# Altium schematic sheet CH32F203C8T6-R1.SchDoc
size 436 x 317 mm; SheetNumber: 1; SheetTotal: 1
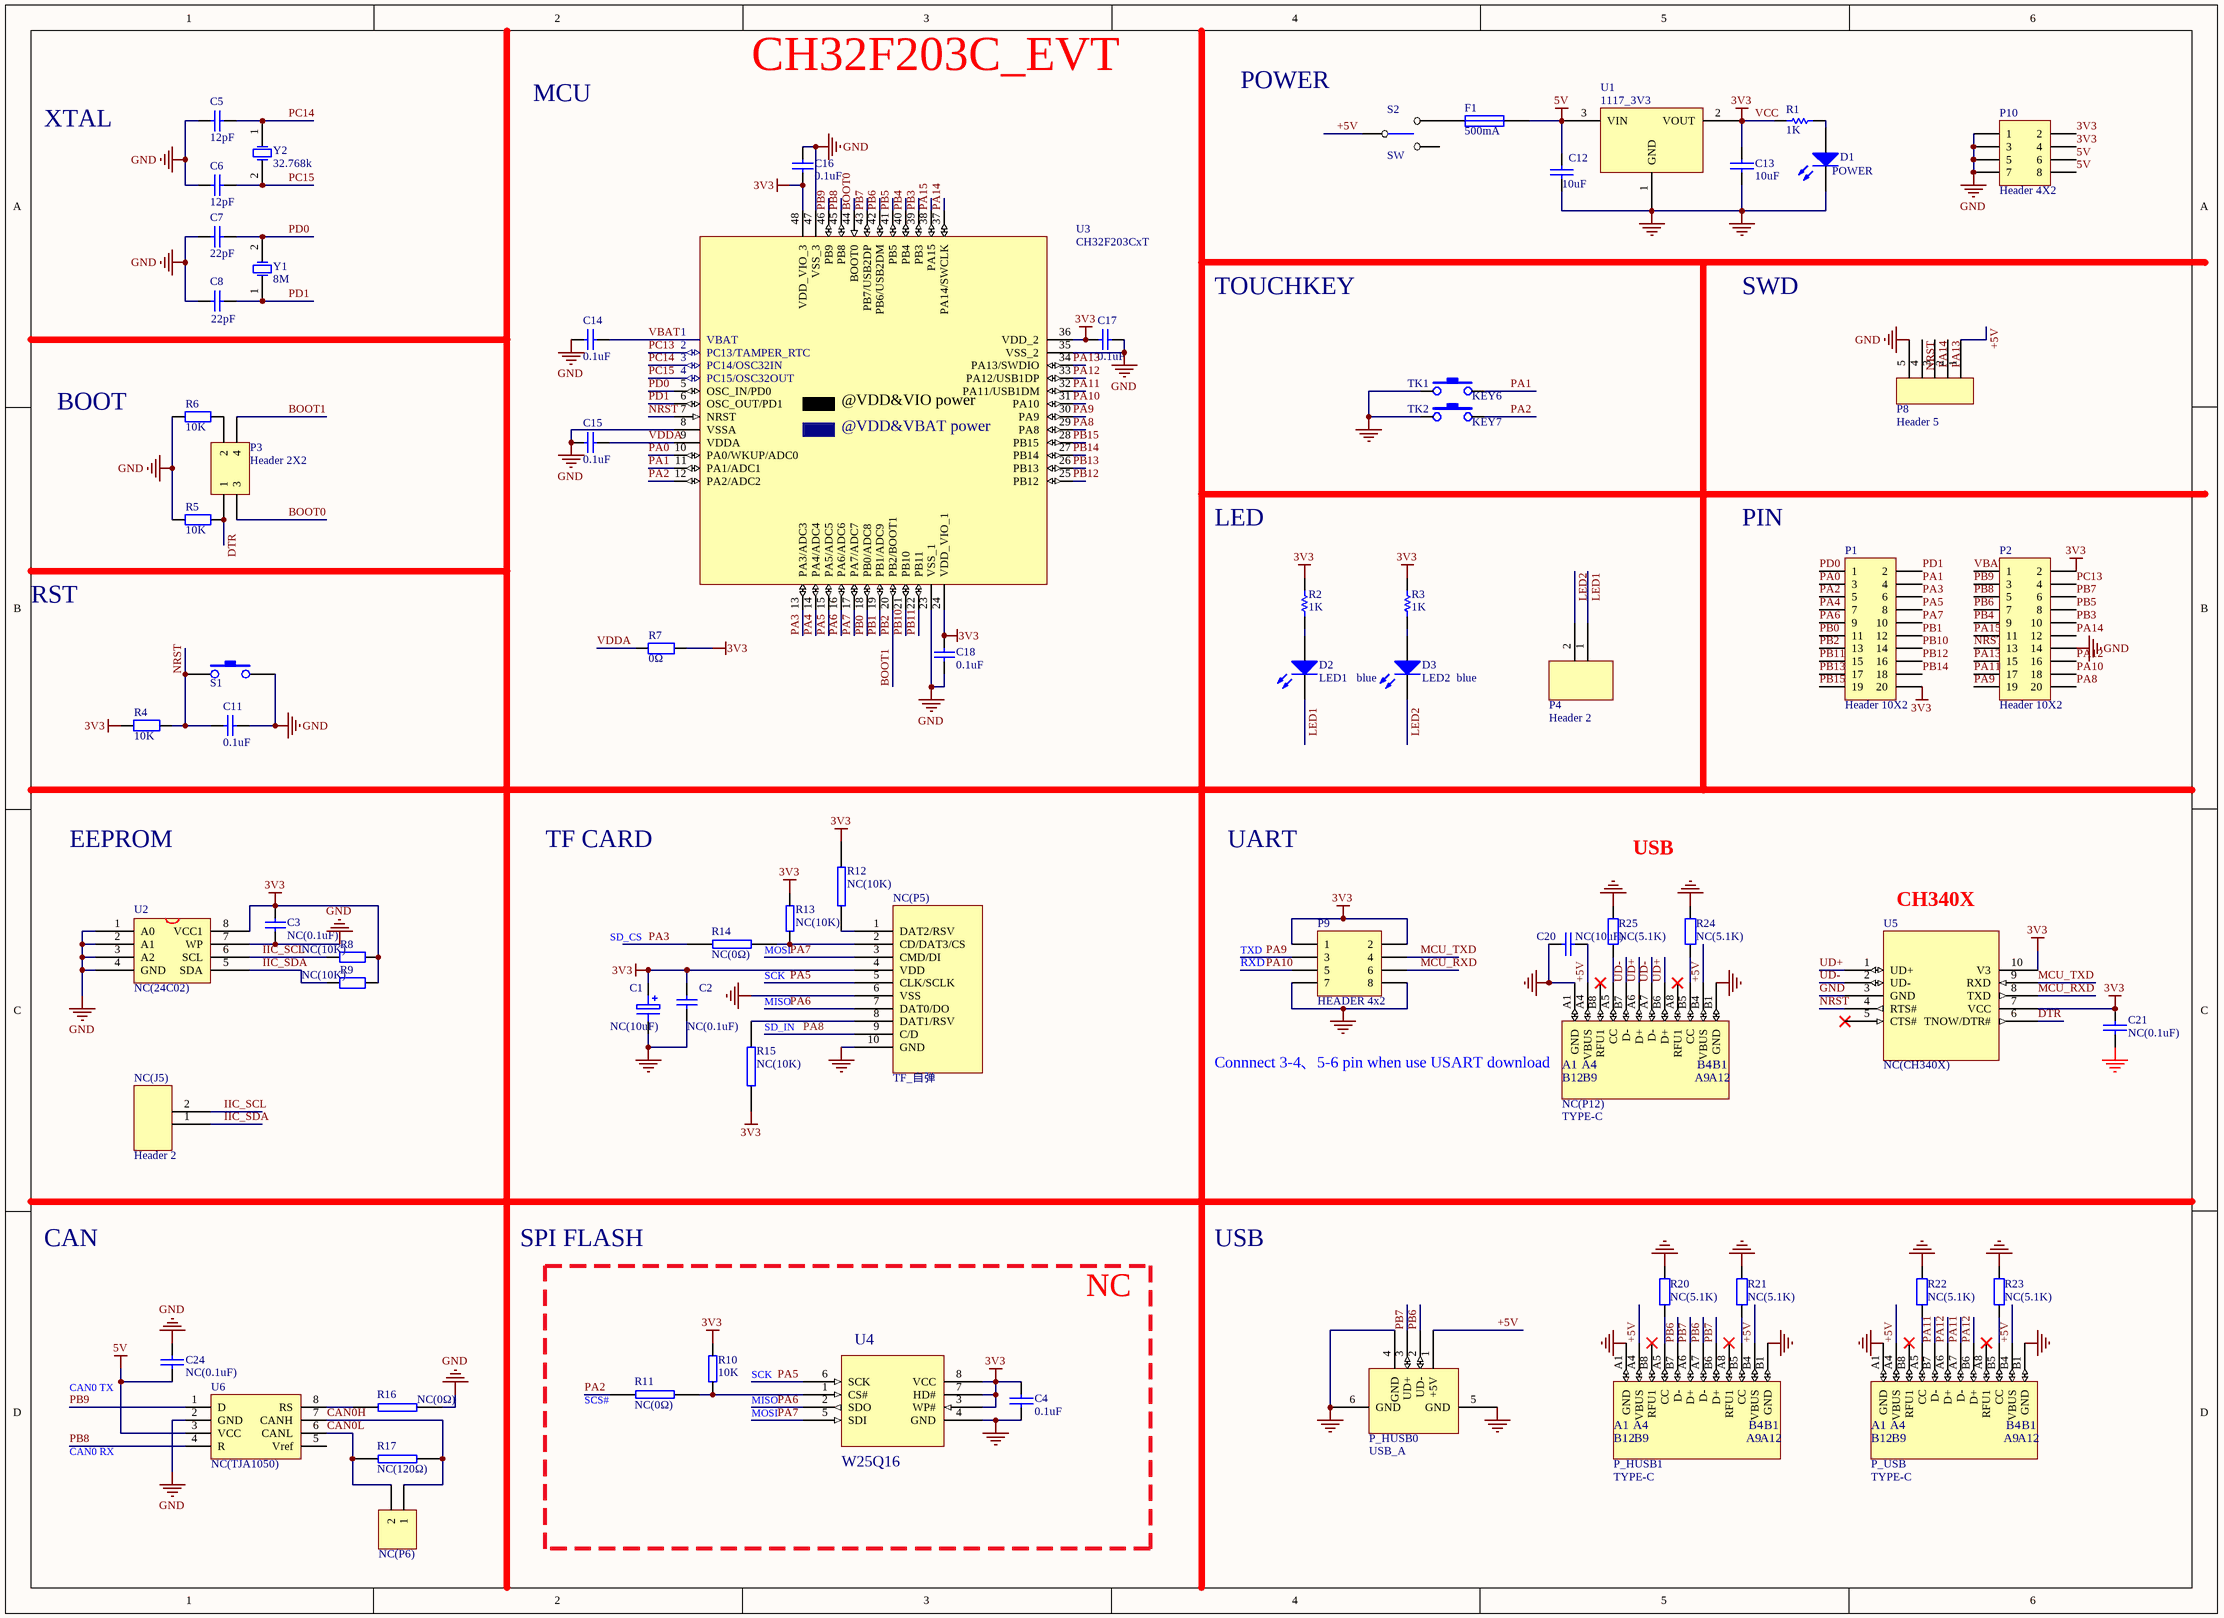
[diagram p0: CH32F203C8T6-R1.SchDoc]

## Parts
C1  NC(10uF)  [3216]
C2  value NC(0.1uF)  [0603]  (hidden comment: 0.1uF)
C3  NC(0.1uF)  [0603]
C4  0.1uF  [0603]
C5  12pF  [0603]
C6  12pF  [0603]
C7  22pF  [0603]
C8  22pF  [0603]
C11  0.1uF  [0603]
C12  10uF  [3216]
C13  10uF  [0603]
C14  0.1uF  [0603]
C15  0.1uF  [0603]
C16  0.1uF  [0603]
C17  0.1uF  [0603]
C18  0.1uF  [0603]
C20  NC(10uF)  [3216_C]
C21  NC(0.1uF)  [0603_C]
C24  NC(0.1uF)  [0603]
D1  POWER  [0603L]
D2  LED1   blue  [0603L]
D3  LED2  blue  [0603L]
F1  500mA  [0603]
NC(J5)  Header 2  [SIP2 - 40mil]
NC(P5)  TF_自弹  [TF_CARD]
NC(P6)  Header 2  [PORT2 4.5MM]  (value not drawn)
NC(P12)  TYPE-C  [TYPE-C-Receptacle-2.0]
P1  Header 10X2  [IDC20]
P2  Header 10X2  [IDC20]
P3  Header 2X2  [HDR2X2]
P4  Header 2  [SIP2 - 40mil]
P8  Header 5  [SIP5 - 40mil]
P9  HEADER 4x2  [IDC8-2.54mm]
P10  Header 4X2  [IDC8]
P_HUSB0  USB_A  [USBA-l]
P_HUSB1  TYPE-C  [TYPE-C-Receptacle-2.0]
P_USB  TYPE-C  [TYPE-C-Receptacle-2.0]
R1  1K  [0603]
R2  1K  [0603]
R3  1K  [0603]
R4  10K  [0603]
R5  10K  [0603]
R6  10K  [0603]
R7  0Ω  [0603]
R8  NC(10K)  [0603]
R9  NC(10K)  [0603]
R10  10K  [0603]
R11  NC(0Ω)  [0603]
R12  NC(10K)  [0603]
R13  NC(10K)  [0603]
R14  NC(0Ω)  [0603]
R15  NC(10K)  [0603]
R16  NC(0Ω)  [0603]
R17  NC(120Ω)  [0603]
R20  NC(5.1K)  [0603]
R21  NC(5.1K)  [0603]
R22  NC(5.1K)  [0603]
R23  NC(5.1K)  [0603]
R24  NC(5.1K)  [0603]
R25  NC(5.1K)  [0603]
S1  KEY  [贴片按键]  (value not drawn)
S2  SW  [KEY2]
TK1  KEY6  [KEY68]
TK2  KEY7  [KEY68]
U1  1117_3V3  [SOT-223]
U2  NC(24C02)  [SOP8]
U3  CH32F203CxT  [LQFP48]
U4  W25Q16  [016 SO-8]
U5  NC(CH340X)  [MSOP10]
U6  NC(TJA1050)  [SOP8]
Y1  8M  [XT62/28]
Y2  32.768k  [FC-135]

## Blocks framed on the sheet
NC: C4 R10 R11 U4

## Nets
3V3: C1.1 C2.1 C3.2 C4.2 C13.1 C16.2 C17.2 C18.2 C21.1 NC(P5).4(VDD) P1.20 P2.2 P9.1 P9.2 P10.2 P10.4 R1.2 R2.1 R3.1 R4.2 R7.1 R8.1 R9.1 R10.2 R12.2 R13.2 R15.1 U1.2(VOUT) U2.8(VCC1) U3.24(VDD_VIO_1) U3.36(VDD_2) U3.48(VDD_VIO_3) U4.3(WP#) U4.7(HD#) U4.8(VCC) U5.7(VCC) U5.10(V3)  [also labelled VCC]
5V: C12.1 C24.2 F1.2 P10.6 P10.8 U1.3(VIN) U6.3(VCC)
GND: C1.2 C2.2 C3.1 C4.1 C5.2 C6.2 C7.1 C8.1 C11.1 C12.2 C13.2 C14.2 C15.2 C16.1 C17.1 C18.1 C20.1 C21.2 C24.1 D1.2(K) NC(P5).6(VSS) NC(P5).10(GND) NC(P12).A1(GND) NC(P12).B1(GND) P2.14 P8.5 P9.7 P9.8 P10.1 P10.3 P10.5 P10.7 P_HUSB0.4(GND) P_HUSB0.5(GND) P_HUSB0.6(GND) P_HUSB1.A1(GND) P_HUSB1.B1(GND) P_USB.A1(GND) P_USB.B1(GND) R5.2 R6.2 R16.1 R20.2 R21.2 R22.2 R23.2 R24.2 R25.2 S1.3 TK1.3 TK2.3 U1.1(GND) U2.1(A0) U2.2(A1) U2.3(A2) U2.4(GND) U2.7(WP) U3.8(VSSA) U3.23(VSS_1) U3.35(VSS_2) U3.47(VSS_3) U4.4(GND) U5.3(GND) U6.2(GND)
+5V: C20.2 NC(P12).A4(VBUS) NC(P12).B4(VBUS) P8.1 P_HUSB0.1(+5V) P_HUSB1.A4(VBUS) P_HUSB1.B4(VBUS) P_USB.A4(VBUS) P_USB.B4(VBUS) S2.1
BOOT0: P3.3 U3.44(BOOT0)
BOOT1: P1.13 P3.4 U3.20(PB2/BOOT1)  [also labelled PB2]
CAN0H: NC(P6).1 R17.1 U6.7(CANH)
CAN0L: NC(P6).2 R17.2 U6.6(CANL)
DTR: P3.1 R5.1 U5.6(TNOW/DTR#)
IIC_SCL: NC(J5).2 R8.2 U2.6(SCL)
IIC_SDA: NC(J5).1 R9.2 U2.5(SDA)
LED1: D2.2(K) P4.1
LED2: D3.2(K) P4.2
MCU_RXD: P9.6 U5.8(TXD)
MCU_TXD: P9.4 U5.9(RXD)
NRST: C11.2 P2.13 P8.4 R4.1 S1.1 U3.7(NRST) U5.4(RTS#)
PA0: P1.3 U3.10(PA0/WKUP/ADC0)
PA1: P1.4 TK1.1 U3.11(PA1/ADC1)
PA2: P1.5 R11.2 TK2.1 U3.12(PA2/ADC2)
PA3: P1.6 R14.2 U3.13(PA3/ADC3)
PA4: P1.7 U3.14(PA4/ADC4)
PA5: NC(P5).5(CLK/SCLK) P1.8 U3.15(PA5/ADC5) U4.6(SCK)
PA6: NC(P5).7(DAT0/DO) P1.9 U3.16(PA6/ADC6) U4.2(SDO)
PA7: NC(P5).3(CMD/DI) P1.10 U3.17(PA7/ADC7) U4.5(SDI)
PA8: NC(P5).9(C/D) P2.20 U3.29(PA8)
PA9: P2.19 P9.3 U3.30(PA9)
PA10: P2.18 P9.5 U3.31(PA10)
PA11: P2.17 P_USB.A7(D-) P_USB.B7(D-) U3.32(PA11/USB1DM)
PA12: P2.16 P_USB.A6(D+) P_USB.B6(D+) U3.33(PA12/USB1DP)
PA13: P2.15 P8.2 U3.34(PA13/SWDIO)
PA14: P2.12 P8.3 U3.37(PA14/SWCLK)
PA15: P2.11 U3.38(PA15)
PB0: P1.11 U3.18(PB0/ADC8)
PB1: P1.12 U3.19(PB1/ADC9)
PB3: P2.10 U3.39(PB3)
PB4: P2.9 U3.40(PB4)
PB5: P2.8 U3.41(PB5)
PB6: P2.7 P_HUSB0.2(UD-) P_HUSB1.A7(D-) P_HUSB1.B7(D-) U3.42(PB6/USB2DM)
PB7: P2.6 P_HUSB0.3(UD+) P_HUSB1.A6(D+) P_HUSB1.B6(D+) U3.43(PB7/USB2DP)
PB8: P2.5 U3.45(PB8) U6.4(R)
PB9: P2.3 U3.46(PB9) U6.1(D)
PB10: P1.14 U3.21(PB10)
PB11: P1.15 U3.22(PB11)
PB12: P1.16 U3.25(PB12)
PB13: P1.17 U3.26(PB13)
PB14: P1.18 U3.27(PB14)
PB15: P1.19 U3.28(PB15)
PC13: P2.4 U3.2(PC13/TAMPER_RTC)
PC14: C5.1 U3.3(PC14/OSC32IN) Y2.1(OSC1)
PC15: C6.1 U3.4(PC15/OSC32OUT) Y2.2(OSC2)
PD0: C7.2 P1.1 U3.5(OSC_IN/PD0) Y1.2(OSC2)
PD1: C8.2 P1.2 U3.6(OSC_OUT/PD1) Y1.1(OSC1)
UD+: NC(P12).A6(D+) NC(P12).B6(D+) U5.1(UD+)
UD-: NC(P12).A7(D-) NC(P12).B7(D-) U5.2(UD-)
VBAT: C14.1 P2.1 U3.1(VBAT)
VDDA: C15.1 R7.2 U3.9(VDDA)
NetD1_1: D1.1(A) R1.1
NetD2_1: D2.1(A) R2.2
NetD3_1: D3.1(A) R3.2
NetF1_1: F1.1 S2.2
NetNC(P5)_1: NC(P5).1(DAT2/RSV) R12.1
NetNC(P5)_2: NC(P5).2(CD/DAT3/CS) R13.1 R14.1
NetNC(P5)_8: NC(P5).8(DAT1/RSV) R15.2
NetNC(P12)_A5: NC(P12).A5(CC) R25.1
NetNC(P12)_B5: NC(P12).B5(CC) R24.1
NetP3_2: P3.2 R6.1
NetP_HUSB1_A5: P_HUSB1.A5(CC) R20.1
NetP_HUSB1_B5: P_HUSB1.B5(CC) R21.1
NetP_USB_A5: P_USB.A5(CC) R22.1
NetP_USB_B5: P_USB.B5(CC) R23.1
NetR10_1: R10.1 R11.1 U4.1(CS#)
NetR16_2: R16.2 U6.8(RS)

Not connected (* = marked no-connect by the designer): NC(P12) A8(RFU1)* B8(RFU1)*; P_HUSB1 A8(RFU1)* B8(RFU1)*; P_USB A8(RFU1)* B8(RFU1)*; S2 3; U5 5(CTS#)*; U6 5(Vref)

## Notes on the sheet
- CH32F203C_EVT
- POWER
- XTAL
- MCU
- TOUCHKEY
- SWD
- BOOT
- LED
- PIN
- RST
- EEPROM
- TF CARD
- UART
- USB
- CH340X
- SD_CS
- MOSI
- SCK
- RXD
- TXD
- MISO
- (near R15) SD_IN
- (near NC(P12)) Connnect 3-4、5-6 pin when use USART download
- CAN
- SPI FLASH
- (near R10) SCK
- CAN0 TX
- (near R11) SCS#
- (near R10) MISO
- CAN0 RX
- (in symbol CH32F203CxT) @VDD&VIO power; @VDD&VBAT power
- (in symbol TYPE-C1) B12; B9; A9; A12

## Library data of the parts
C1 = ELECTRO1: Electrolytic Capacitor; Value: 10uF/16V
C2 C3 C5-C8 C11 C14-C18 = Cap: Capacitor; Published: 8-Jun-2000; Publisher: Altium Limited
  C2: Revision: July-2002: Re-released for DXP Platform.
  C3 C5-C8 C14 C15 C17 C18: LatestRevisionDate: 17-Jul-2002; LatestRevisionNote: Re-released for DXP Platform.; PackageReference: RAD-0.3
  C11 C16: LatestRevisionDate: 17-Jul-2002; LatestRevisionNote: Re-released for DXP Platform.; PackageReference: RAD-0.3; Value: 0.1uF
C4 C12 C13 C20 C21 C24 = CAP: Capacitor
D1-D3 = LED0: Typical INFRARED GaAs LED; Published: 8-Jun-2000; LatestRevisionDate: 08-Jul-2005; LatestRevisionNote: Mech Layer 1 removed.; PackageReference: LED-0; Publisher: Altium Limited
F1 = FUSE1: Fuse
NC(J5) P4 P8 = 2HEAD
NC(P6) = Header 2: Header, 2-Pin; LatestRevisionDate: 17-Jul-2002; LatestRevisionNote: Re-released for DXP Platform.; Publisher: Altium Limited
NC(P12) P_HUSB1 P_USB = TYPE-C1
P1 P2 = Header 10X2: Header, 10-Pin, Dual row; LatestRevisionDate: 17-Jul-2002; LatestRevisionNote: Re-released for DXP Platform.; Publisher: Altium Limited
P3 = Header 2X2: Header, 2-Pin, Dual row; LatestRevisionDate: 17-Jul-2002; LatestRevisionNote: Re-released for DXP Platform.; Publisher: Altium Limited
P9 = HEADER 4x2: Header, 4-Pin, Dual row
P10 = Header 4X2: Header, 4-Pin, Dual row; LatestRevisionDate: 17-Jul-2002; LatestRevisionNote: Re-released for DXP Platform.; Publisher: Altium Limited
P_HUSB0 = USB: USB Port
R1-R3 = Res Semi: Semiconductor Resistor; Published: 8-Jun-2000; LatestRevisionDate: 17-Jul-2002; LatestRevisionNote: Re-released for DXP Platform.; PackageReference: AXIAL-0.5; Publisher: Altium Limited; Value: 1K
R4-R9 R20-R25 = Res2: Resistor
  R4-R6 R8 R9: Published: 8-Jun-2000; LatestRevisionDate: 17-Jul-2002; LatestRevisionNote: Re-released for DXP Platform.; PackageReference: AXIAL-0.4; Publisher: Altium Limited; Value: 10K
  R7: Published: 8-Jun-2000; LatestRevisionDate: 17-Jul-2002; LatestRevisionNote: Re-released for DXP Platform.; PackageReference: AXIAL-0.4; Publisher: Altium Limited
R10 R13 = DZ
R11 R12 R14-R17 = RES2
TK1 TK2 = KEY
U1 = LM1117_3.3V
U2 = 24C256
U3 = CH32F203CxT: ARM M3 LMD-MCU, 144MHz, 2*USB FS, CAN
U4 = Pro89C.tmp_25F512_2
U5 = CH340X: USB to TTL Serial / UART
U6 = Component_1
Y1 Y2 = XTAL: Crystal Oscillator; Published: 8-Jun-2000; LatestRevisionDate: 17-Jul-2002; LatestRevisionNote: Re-released for DXP Platform.; PackageReference: R38; Publisher: Altium Limited